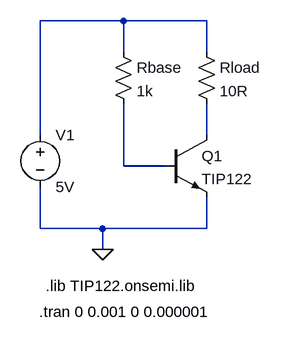
[diagram p0: schematic TIP122-demo.asc]
TIP122-demo.asc, the LTspice schematic file:
Version 4
SHEET 1 880 680
WIRE 144 -48 16 -48
WIRE 272 -48 144 -48
WIRE 144 0 144 -48
WIRE 272 0 272 -48
WIRE 16 128 16 -48
WIRE 272 128 272 80
WIRE 144 176 144 80
WIRE 208 176 144 176
WIRE 16 272 16 208
WIRE 112 272 16 272
WIRE 272 272 272 224
WIRE 272 272 112 272
WIRE 112 304 112 272
FLAG 112 304 0
SYMBOL npn 208 128 R0
SYMATTR InstName Q1
SYMATTR Value TIP122
SYMATTR Prefix X
SYMBOL voltage 16 112 R0
SYMATTR InstName V1
SYMATTR Value 5V
SYMBOL res 256 -16 R0
SYMATTR InstName Rload
SYMATTR Value 10R
SYMBOL res 128 -16 R0
SYMATTR InstName Rbase
SYMATTR Value 1k
TEXT 24 360 Left 2 !.lib TIP122.onsemi.lib
TEXT 14 400 Left 2 !.tran 0 0.001 0 0.000001

The netlist it stands for:
* TIP122-demo.asc
XQ1 N002 N003 0 TIP122  ; pins C B E
V1 N001 0 5V
Rload N001 N002 10R
Rbase N001 N003 1k
.lib TIP122.onsemi.lib
.tran 0 0.001 0 0.000001
.backanno
.end